# EAGLE schematic rc360detector_102415_7_15 (EAGLE 7.4.0)
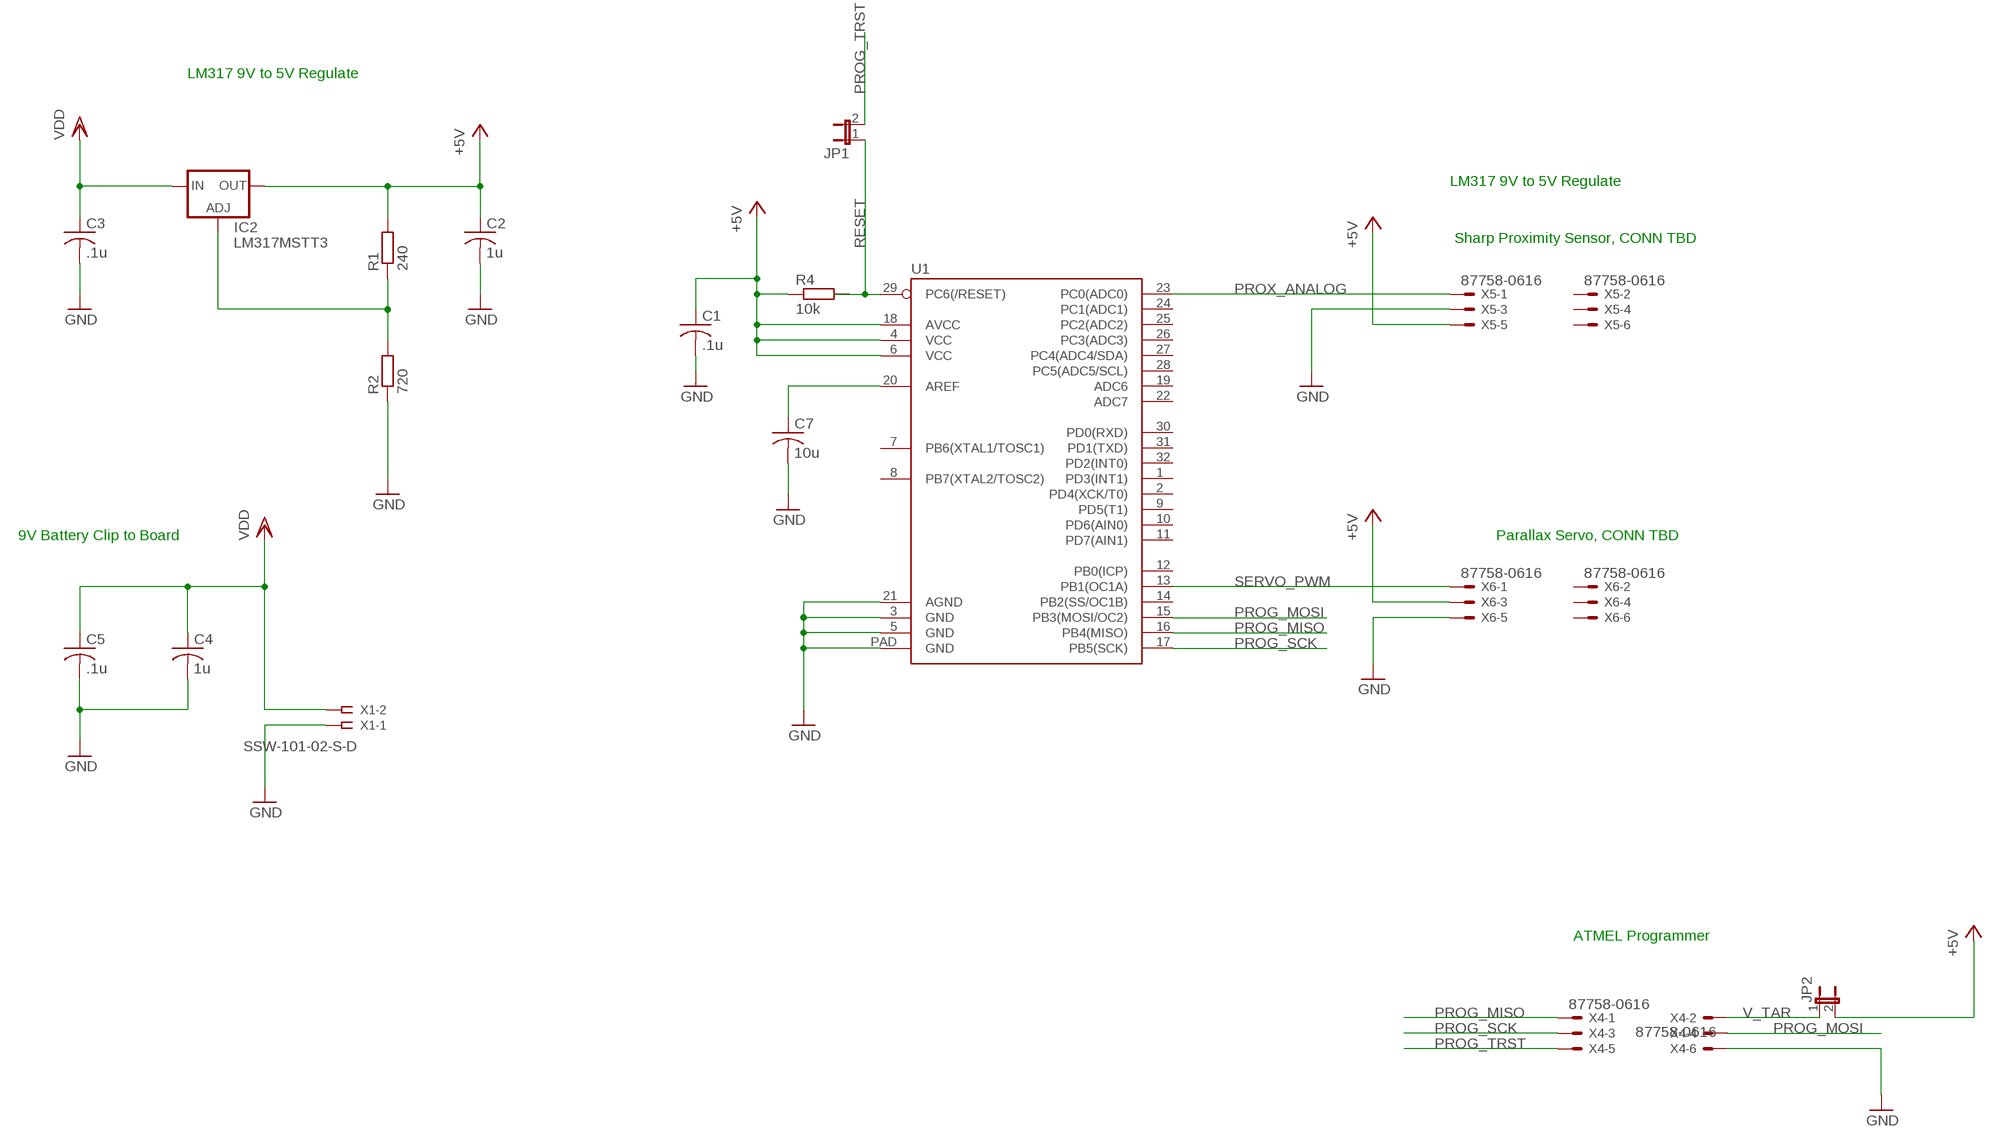
[diagram p0: schematic, sheet 1]

## Parts
C1  .1u  C-USC0603  [C0603]
C2  1u  C-USC0603  [C0603]
C3  .1u  C-USC0603  [C0603]
C4  1u  C-USC0603  [C0603]
C5  .1u  C-USC0603  [C0603]
C7  10u  C-USC0603  [C0603]
IC2  LM317MSTT3  [SOT223]
JP1  JP1E  [JP1]
JP2  JP1E  [JP1]
R1  240  R-EU_R0603  [R0603]
R2  720  R-EU_R0603  [R0603]
R4  10k  R-EU_R0603  [R0603]
U1  ATMEGA328P_MLFMLF32  [MLF32-PAD]
X1  SSW-101-02-S-D  [SSW-101-02-S-D]
X4  87758-0616  [87758-0616]
X5  87758-0616  [87758-0616]
X6  87758-0616  [87758-0616]

## Nets
+5V: C1.1 C2.1 IC2.4(OUT) JP2.2 R1.2 R4.1 U1.4(VCC) U1.6(VCC) U1.18(AVCC) X5.5 X6.3
AREF: C7.1 U1.20(AREF)
GND: C1.2 C2.2 C3.2 C4.2 C5.2 C7.2 R2.1 U1.3(GND) U1.5(GND) U1.21(AGND) U1.PAD(GND) X1.1 X4.6 X5.3 X6.5
N$2: IC2.1(ADJ) R1.1 R2.2
PROG_MISO: U1.16(PB4(MISO)) X4.1
PROG_MOSI: U1.15(PB3(MOSI/OC2)) X4.4
PROG_SCK: U1.17(PB5(SCK)) X4.3
PROG_TRST: JP1.2 X4.5
PROX_ANALOG: U1.23(PC0(ADC0)) X5.1
RESET: JP1.1 R4.2 U1.29(PC6(/RESET))
SERVO_PWM: U1.13(PB1(OC1A)) X6.1
V_TAR: JP2.1 X4.2
VDD: C3.1 C4.1 C5.1 IC2.3(IN) X1.2
Unconnected: U1.1(PD3(INT1)) U1.2(PD4(XCK/T0)) U1.7(PB6(XTAL1/TOSC1)) U1.8(PB7(XTAL2/TOSC2)) U1.9(PD5(T1)) U1.10(PD6(AIN0)) U1.11(PD7(AIN1)) U1.12(PB0(ICP)) U1.14(PB2(SS/OC1B)) U1.19(ADC6) U1.22(ADC7) U1.24(PC1(ADC1)) U1.25(PC2(ADC2)) U1.26(PC3(ADC3)) U1.27(PC4(ADC4/SDA)) U1.28(PC5(ADC5/SCL)) U1.30(PD0(RXD)) U1.31(PD1(TXD)) U1.32(PD2(INT0)) X5.2 X5.4 X5.6 X6.2 X6.4 X6.6

## Notes on the sheet
- LM317 9V to 5V Regulate
- LM317 9V to 5V Regulate
- Sharp Proximity Sensor, CONN TBD
- 9V Battery Clip to Board | Parallax Servo, CONN TBD
- ATMEL Programmer

## Library data of the parts
C1-C5 C7 = resistor:C-US: CAPACITOR, American symbol
IC2 = v-reg:LM317?*: 500 mA Adjustable Output Positive Voltage Regulator Source: http://www.onsemi.co.jp .. LM317M-D.PDF
JP1 JP2 = jumper:JP1E: JUMPER
R1 R2 R4 = resistor:R-EU_: RESISTOR, European symbol
U1 = SparkFun-DigitalIC:ATMEGA328P_MLF: 32-Pin Atmega328 part Commonly used on Arduino compatible boards Available in QFP and QFN packages TQFP is IC-09069 QFN is non-stock
X1 = con-samtec:SSW-101-02-S-D: THROUGH-HOLE .025" SQ POST SOCKET Source: Samtec SSW.pdf; MPN: SSW-101-02-S-D; OC_FARNELL: unknown; OC_NEWARK: 82P1456
X4-X6 = con-molex:87758-0616: 6 Pin - 2mm Dual Row Single Wafer, Vertical T/H HDR Source: http://www.molex.com/pdm_docs/sd/877580616_sd.pdf; MPN: 87758-0616; OC_FARNELL: 7472323; OC_NEWARK: 25M5667